# EAGLE design FTDI-UART-I2C (EAGLE 6.3)
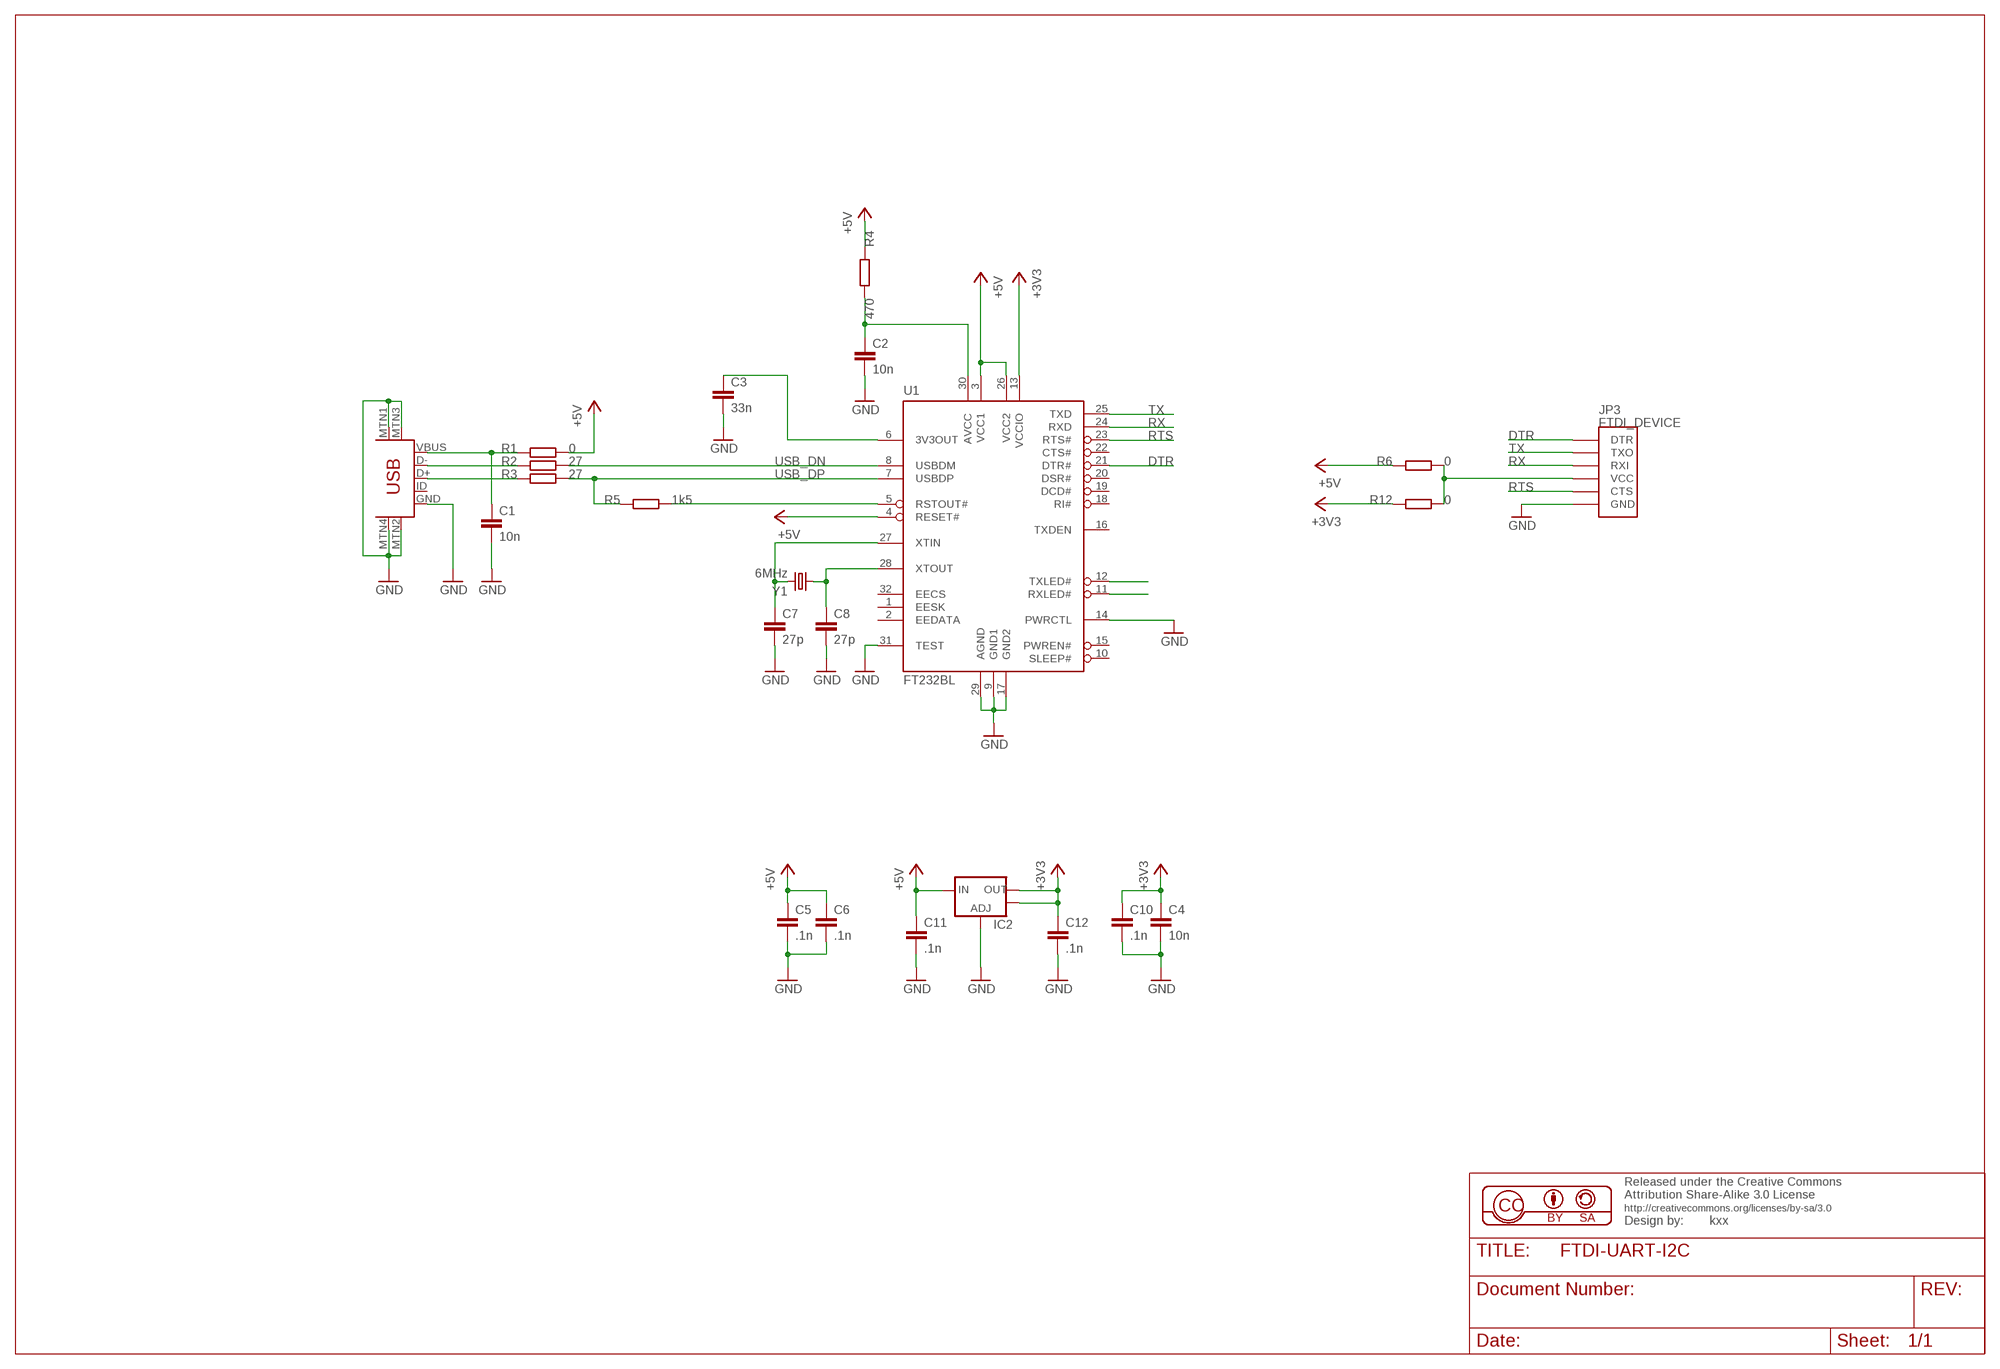
[diagram p0: schematic, sheet 1]

## Parts
C1  10n  C-EUC0805  [C0805]
C2  10n  C-EUC0805  [C0805]
C3  33n  C-EUC0805  [C0805]
C4  10n  C-EUC0805  [C0805]
C5  .1n  C-EUC0805  [C0805]
C6  .1n  C-EUC0805  [C0805]
C7  27p  C-EUC0805  [C0805]
C8  27p  C-EUC0805  [C0805]
C10  .1n  C-EUC0805  [C0805]
C11  .1n  C-EUC0805  [C0805]
C12  .1n  C-EUC0805  [C0805]
IC2  V_REG_LM1117SOT223  [SOT223]
JP3  FTDI_DEVICE  [FTDI_DEVICE_SIDE]
R1  0  R-EU_R0603  [R0603]
R2  27  R-EU_R0603  [R0603]
R3  27  R-EU_R0603  [R0603]
R4  470  R-EU_R0603  [R0603]
R5  1k5  R-EU_R0603  [R0603]
R6  0  R-EU_R0603  [R0603]
R12  0  R-EU_R0603  [R0603]
U1  FT232BL  [LQFP32]
U$2  USB-MINIB-5PIN  [USB-MINIB]
Y1  6MHz  CRYSTALHC49UV  [HC49U-V]

## Nets
+3V3: C4.1 C10.1 C12.1 IC2.2(OUT) IC2.4(OUT) R12.1 U1.13(VCCIO)
+5V: C5.1 C6.1 C11.1 IC2.3(IN) R1.2 R4.1 R6.1 U1.3(VCC1) U1.4(RESET#) U1.26(VCC2)
DTR: JP3.P$1(DTR) U1.21(DTR#)
GND: C1.2 C2.2 C3.2 C4.2 C5.2 C6.2 C7.2 C8.2 C10.2 C11.2 C12.2 IC2.1(ADJ) JP3.P$6(GND) U1.9(GND1) U1.14(PWRCTL) U1.17(GND2) U1.29(AGND) U1.31(TEST) U$2.GND U$2.MTN1(MTN2) U$2.MTN2(MTN3) U$2.MTN3(MTN1) U$2.MTN4
N$1: C1.1 R1.1 U$2.VBUS
N$2: R2.1 U$2.D-
N$3: R3.1 U$2.D+
N$4: U1.12(TXLED#)
N$5: C2.1 R4.2 U1.30(AVCC)
N$6: C3.1 U1.6(3V3OUT)
N$7: C7.1 U1.27(XTIN) Y1.2
N$8: C8.1 U1.28(XTOUT) Y1.1
N$9: U1.11(RXLED#)
N$10: R5.2 U1.5(RSTOUT#)
N$11: JP3.P$4(VCC) R6.2 R12.2
RTS: JP3.P$5(CTS) U1.23(RTS#)
RX: JP3.P$3(RXI) U1.24(RXD)
TX: JP3.P$2(TXO) U1.25(TXD)
USB_DN: R2.2 U1.8(USBDM)
USB_DP: R3.2 R5.1 U1.7(USBDP)
Unconnected: U1.1(EESK) U1.2(EEDATA) U1.10(SLEEP#) U1.15(PWREN#) U1.16(TXDEN) U1.18(RI#) U1.19(DCD#) U1.20(DSR#) U1.22(CTS#) U1.32(EECS) U$2.ID

## Library data of the parts
C1-C8 C10-C12 = rcl:C-EU: CAPACITOR, European symbol
IC2 = sparkfun:V_REG_LM1117: Voltage Regulator LM1117 Standard adjustable voltage regulator but in SMD form. Spark Fun Electronics SKU : COM-00595
JP3 = SparkFun-Connectors:FTDI_DEVICE: Connector which mates to FTDI basic or FTDI cable.
R1-R6 R12 = rcl:R-EU_: RESISTOR, European symbol
U1 = ftdichip-4:FT232BL: USB UART 2nd Generation USB UART (USB <-> Serial) Controller
U$2 = sparkfun:USB-MINIB: Mini-USB "B" connector with 5th pin broken out. Created new symbol breaking out 5th "ID" pin in mini/micro USB connector spec. See: http://en.wikipedia.org/wiki/Mini_usb#Cables. Uses same footprint as 4-pin symbol. Also added pins to connect to mounting / shield pads if required (probably not generally needed as signals aren't shielded once they leave the connector).
Y1 = sparkfun:CRYSTAL: Crystals Various standard crystals. Proven footprints. Spark Fun Electronics SKU : COM-00534

## Board
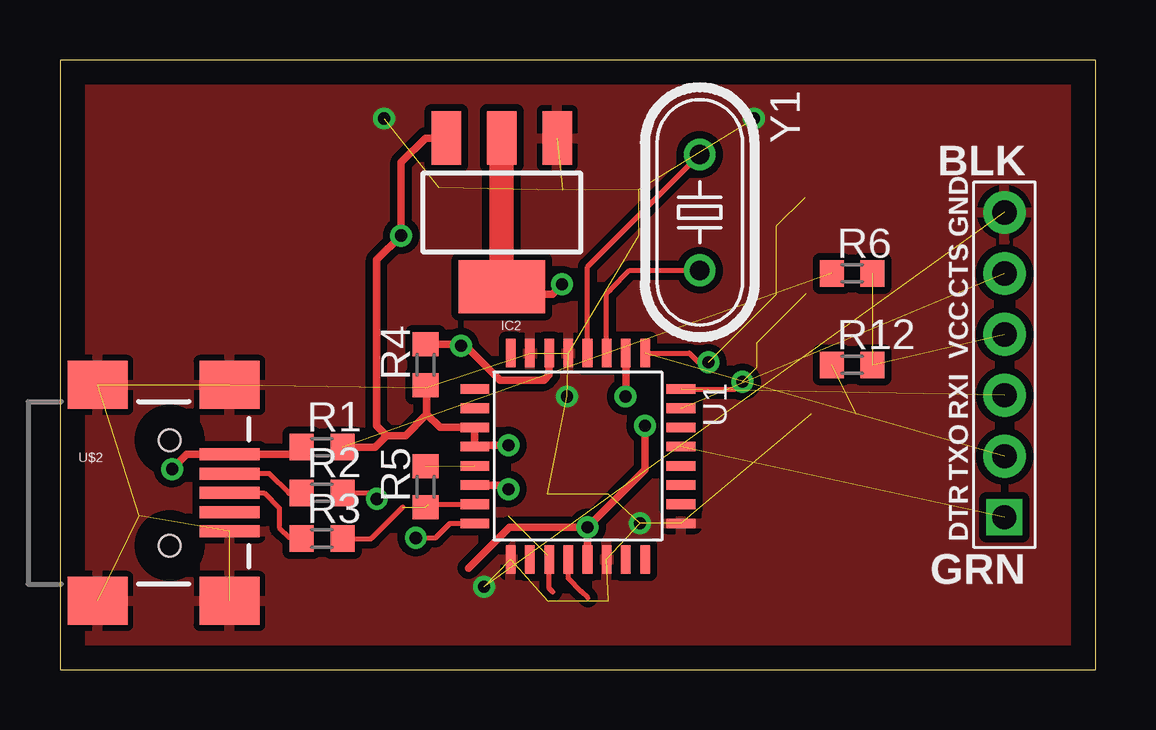
[diagram p1: board, top side]
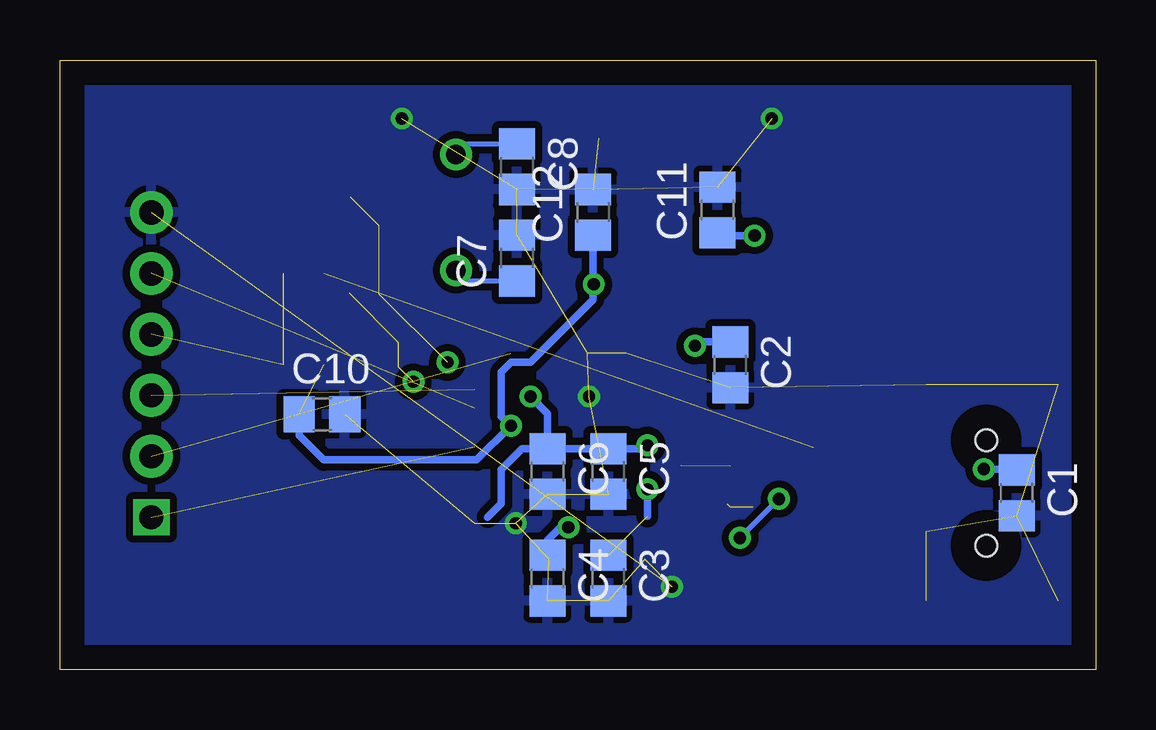
[diagram p2: board, bottom side, seen from below]

Size 43.18 x 25.4 mm. Coordinates in mm from the lower left corner, seen from the top.
Outline: 0,0 43.18,0 43.18,25.4 0,25.39 0,0
Copper layers (1*16): Top 0.035mm / dielectric 1.5mm / Bottom 0.035mm
Design rules "default": minimum track width 8mil, minimum drill 20mil, track to track 8mil, track to pad 8mil, pad to pad 8mil, via to via 8mil, smd to smd 8mil, copper to edge 40mil, drill to drill 8mil, minimum pad ring 10mil, minimum via ring 8mil, stop-mask expansion 4mil, vias tented up to drill 20mil, thermal gap 10mil

### Footprints (pad centres in the part's own frame; a part is rotated, then mirrored left to right if it is on the bottom)
C0805 = smd 1.3 x 1.5: 1 -0.95,0; 2 0.95,0
SOT223 = smd 1.219 x 2.235: 1 -2.311,-3.099; 2 0,-3.099; 3 2.311,-3.099 | smd 3.6 x 2.2: 4 0,3.099
FTDI_DEVICE_SIDE = drill 1 square: P$1 -6.35,0 | drill 1.016 pad 1.778: P$2 -3.81,0; P$3 -1.27,0; P$4 1.27,0; P$5 3.81,0; P$6 6.35,0
R0603 = smd 1 x 1.1: 1 -0.85,0; 2 0.85,0
LQFP32 = smd 0.4 x 1.2: 1 -2.8,-4.3; 2 -2,-4.3; 3 -1.2,-4.3; 4 -0.4,-4.3; 5 0.4,-4.3; 6 1.2,-4.3; 7 2,-4.3; 8 2.8,-4.3; 17 2.8,4.3; 18 2,4.3; 19 1.2,4.3; 20 0.4,4.3; 21 -0.4,4.3; 22 -1.2,4.3; 23 -2,4.3; 24 -2.8,4.3 | smd 1.2 x 0.4: 9 4.3,-2.8; 10 4.3,-2; 11 4.3,-1.2; 12 4.3,-0.4; 13 4.3,0.4; 14 4.3,1.2; 15 4.3,2; 16 4.3,2.8; 25 -4.3,2.8; 26 -4.3,2; 27 -4.3,1.2; 28 -4.3,0.4; 29 -4.3,-0.4; 30 -4.3,-1.2; 31 -4.3,-2; 32 -4.3,-2.8
USB-MINIB = smd 2.5 x 0.5: D+ 2.5,0; D- 2.5,0.8; GND 2.5,-1.6; ID 2.5,-0.8; VBUS 2.5,1.6 | smd 2.5 x 2: MTN1 -3,4.5; MTN2 2.5,4.5; MTN3 -3,-4.5; MTN4 2.5,-4.5 | hole 0.9: 0,2.2; 0,-2.2
HC49U-V = drill 0.813: 1 -2.413,0; 2 2.413,0

### Placement (x,y rotation side)
C1  3.3,7.37 270 bottom
C2  15.24,12.7 270 bottom
C3  20.32,3.81 270 bottom
C4  22.86,3.81 270 bottom
C5  20.32,8.26 270 bottom
C6  22.86,8.26 270 bottom
C7  24.13,17.14 90 bottom
C8  24.13,20.95 270 bottom
C10  32.26,10.64 0 bottom
C11  15.77,19.15 90 bottom
C12  20.95,19.05 90 bottom
IC2  18.41,19.05 180 top
JP3  39.37,12.7 90 top
R1  10.92,9.27 0 top
R2  10.92,7.37 0 top
R3  10.92,5.46 0 top
R4  15.24,12.7 90 top
R5  15.24,7.62 90 top
R6  33.02,16.51 0 top
R12  33.02,12.7 0 top
U1  21.59,8.89 270 top
U$2  4.57,7.37 0 top
Y1  26.67,19.05 270 top

### Tracks (layer width: path | path; a pad name or v marks a point on that pad's centre or on a via)
+3V3  (via drill 0.51)  (1 unrouted)
  Top 0.305: v24.38,10.16 24.38,8.33 v21.99,5.94 | v21.99,5.94 U1.13 | v21.99,5.94 18.74,5.94 17.03,4.22 | 20.73,15.85 v20.93,16.05 20.52,15.65 18.9,15.65 18.59,15.95 IC2.4
  Top 1.016: IC2.4 IC2.2
  Bottom 0.305: C10.1 33.21,9.76 32.18,8.74 25.81,8.74 v24.38,10.16 24.79,10.57 24.79,12.39 24.38,12.8 23.57,12.8 20.95,15.42 20.95,16.08 | 22.86,5.07 C4.1 22.86,5.38 22.31,5.94 v21.99,5.94 | 20.95,16.08 C12.1 | 20.95,16.08 v20.93,16.05
+5V  (via drill 0.51)  (1 unrouted)
  Top 0.305: 15.29,10.64 15.84,10.09 U1.3 U1.4 17.35,9.35 v18.69,9.35 | 15.29,10.64 15.29,11.8 R4.1 | R1.2 13.13,9.27 13.61,9.75 | 15.29,10.64 14.4,9.75 13.61,9.75 | 13.61,9.75 13.21,10.16 13.21,17.07 v14.22,18.09 14.22,21.13 15.24,22.15 IC2.3 | U1.26 23.59,11.4 v23.57,11.38
  Bottom 0.305: 18.9,9.35 v18.69,9.35 18.84,9.21 C5.1 C6.1 | C6.1 23.92,9.21 24.79,8.33 24.79,6.91 25.35,6.35 | C6.1 22.86,10.67 v23.57,11.38 | 14.63,18.09 v14.22,18.09 15.66,18.09 C11.1
DTR  (1 unrouted)
GND  (via drill 0.51)  (27 unrouted)
  other vias: 17.68,3.45 21.13,11.38 13.51,22.96 28.93,22.96 24.18,6.1
  pour Top (isolate 0.305): 0,0 43.18,0 43.18,25.4 0,25.4
  pour Bottom (isolate 0.305): 0,0 43.18,0 43.18,25.4 0,25.4
N$1  (via drill 0.51)
  Top 0.305: R1.1 9.77,8.97 U$2.VBUS 5.28,8.97 v4.67,8.36
  Bottom 0.305: v4.67,8.36 3.34,8.36 C1.1
N$2
  Top 0.203: U$2.D- 8.72,8.17 9.55,7.34 10.05,7.34 R2.1
N$3
  Top 0.203: U$2.D+ 8.51,7.37 9.14,6.73 9.14,5.92 9.55,5.51 10.02,5.51 R3.1
N$4
  Top 0.203: U1.12 21.19,3.8 21.74,3.25 22.01,2.98
N$5  (via drill 0.51)
  Top 0.305: R4.2 16.65,13.55 v16.71,13.49 16.92,13.49 17.53,12.88 17.93,12.47 18.34,12.06 20.17,12.06 20.39,12.29 U1.30
  Bottom 0.305: C2.1 16.55,13.65 v16.71,13.49
N$6  (via drill 0.51)  (1 unrouted)
  Top 0.305: U1.6 18.52,7.69 v18.69,7.52
  Bottom 0.305: 18.69,6.39 v18.69,7.52
N$7
  Top 0.203: Y1.2 23.75,16.64 22.96,15.85 22.79,15.68 U1.27
  Bottom 0.203: C7.1 26.23,16.2 Y1.2
N$8
  Top 0.203: U1.28 21.99,16.78 Y1.1
  Bottom 0.203: C8.1 26.23,21.91 Y1.1
N$9
  Top 0.203: U1.11 20.39,3.38 20.52,3.25 20.54,3.24
N$10  (1 unrouted)
N$11  (2 unrouted)
RTS  (1 unrouted)
RX  (via drill 0.51)  (4 unrouted)
  Top 0.203: 28.25,11.79 v28.45,11.99 28.15,11.69 U1.24
TX  (via drill 0.51)  (4 unrouted)
  Top 0.203: v27.03,12.8 26.62,12.8 26.23,13.19 U1.25
USB_DN  (via drill 0.51)
  Top 0.203: R2.2 12.95,7.37 v13.21,7.11 | v14.83,5.49 15.65,5.49 16.05,5.89 16.25,6.09 U1.8
  Bottom 0.203: v13.21,7.11 v14.83,5.49
USB_DP  (2 unrouted)
  Top 0.203: 15.36,6.89 U1.7 | 14.29,6.77 13.01,5.49 12.98,5.46 R3.2

### Text on the board
_tsilk: GND | TX | RX | TX | RX
_bsilk: USB-to-UART/485 rev0 | (c) FB 2011